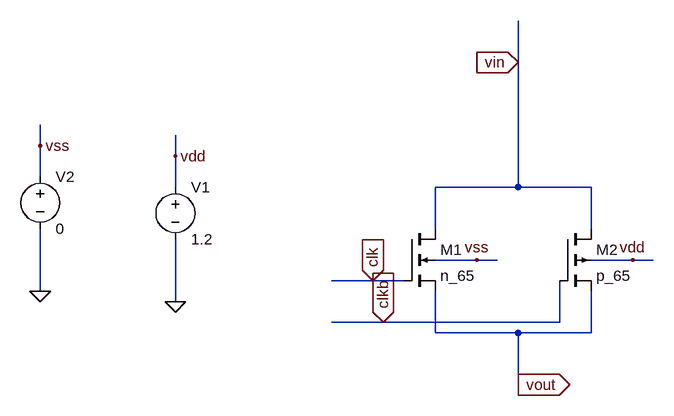
[diagram p0: schematic TG_Switch.asc]
TG_Switch.asc, the LTspice schematic file:
Version 4
SHEET 1 880 680
WIRE 192 -240 192 -304
WIRE -544 -112 -544 -144
WIRE -336 -96 -336 -128
WIRE -544 -64 -544 -112
WIRE -336 -48 -336 -96
WIRE 192 -48 192 -240
WIRE 192 -48 64 -48
WIRE 304 -48 192 -48
WIRE 64 16 64 -48
WIRE 304 16 304 -48
WIRE 128 64 64 64
WIRE 160 64 128 64
WIRE 368 64 304 64
WIRE 400 64 368 64
WIRE -32 96 -96 96
WIRE 16 96 -32 96
WIRE -544 112 -544 16
WIRE -336 128 -336 32
WIRE -16 160 -96 160
WIRE 256 160 256 96
WIRE 256 160 -16 160
WIRE 64 176 64 112
WIRE 192 176 64 176
WIRE 304 176 304 112
WIRE 304 176 192 176
WIRE 192 256 192 176
WIRE 192 272 192 256
FLAG 128 64 vss
FLAG 368 64 vdd
FLAG -32 96 clk
IOPIN -32 96 In
FLAG -16 160 clkb
IOPIN -16 160 In
FLAG 192 -240 vin
IOPIN 192 -240 In
FLAG -336 128 0
FLAG -336 -96 vdd
FLAG -544 112 0
FLAG -544 -112 vss
FLAG 192 256 vout
IOPIN 192 256 Out
SYMBOL nmos4 16 16 R0
SYMATTR InstName M1
SYMATTR Value n_65
SYMATTR Value2 l=1u w=1u
SYMBOL pmos4 256 16 R0
SYMATTR InstName M2
SYMATTR Value p_65
SYMATTR Value2 l=1u w=2u
SYMBOL voltage -336 -64 R0
WINDOW 123 0 0 Left 0
WINDOW 39 0 0 Left 0
SYMATTR InstName V1
SYMATTR Value 1.2
SYMBOL voltage -544 -80 R0
WINDOW 123 0 0 Left 0
WINDOW 39 0 0 Left 0
SYMATTR InstName V2
SYMATTR Value 0

The netlist it stands for:
* TG_Switch.asc
M1 vin clk vout vss n_65 l=1u w=1u
M2 vin clkb vout vdd p_65 l=1u w=2u
V1 vdd 0 1.2
V2 vss 0 0
.model NMOS NMOS
.model PMOS PMOS
.lib standard.mos
.backanno
.end